# Altium schematic sheet Host.SchDoc: TITLE GOES HERE
size C; Author: EBK; CompanyName: Vaddio; Organization: Vaddio; Address1: 131 Cheshire Lane; Address2: Minnetonka, MN  55305; Address3: www.vaddio.com; Address4: 800-572-2011; SheetNumber: 1; SheetTotal: 1
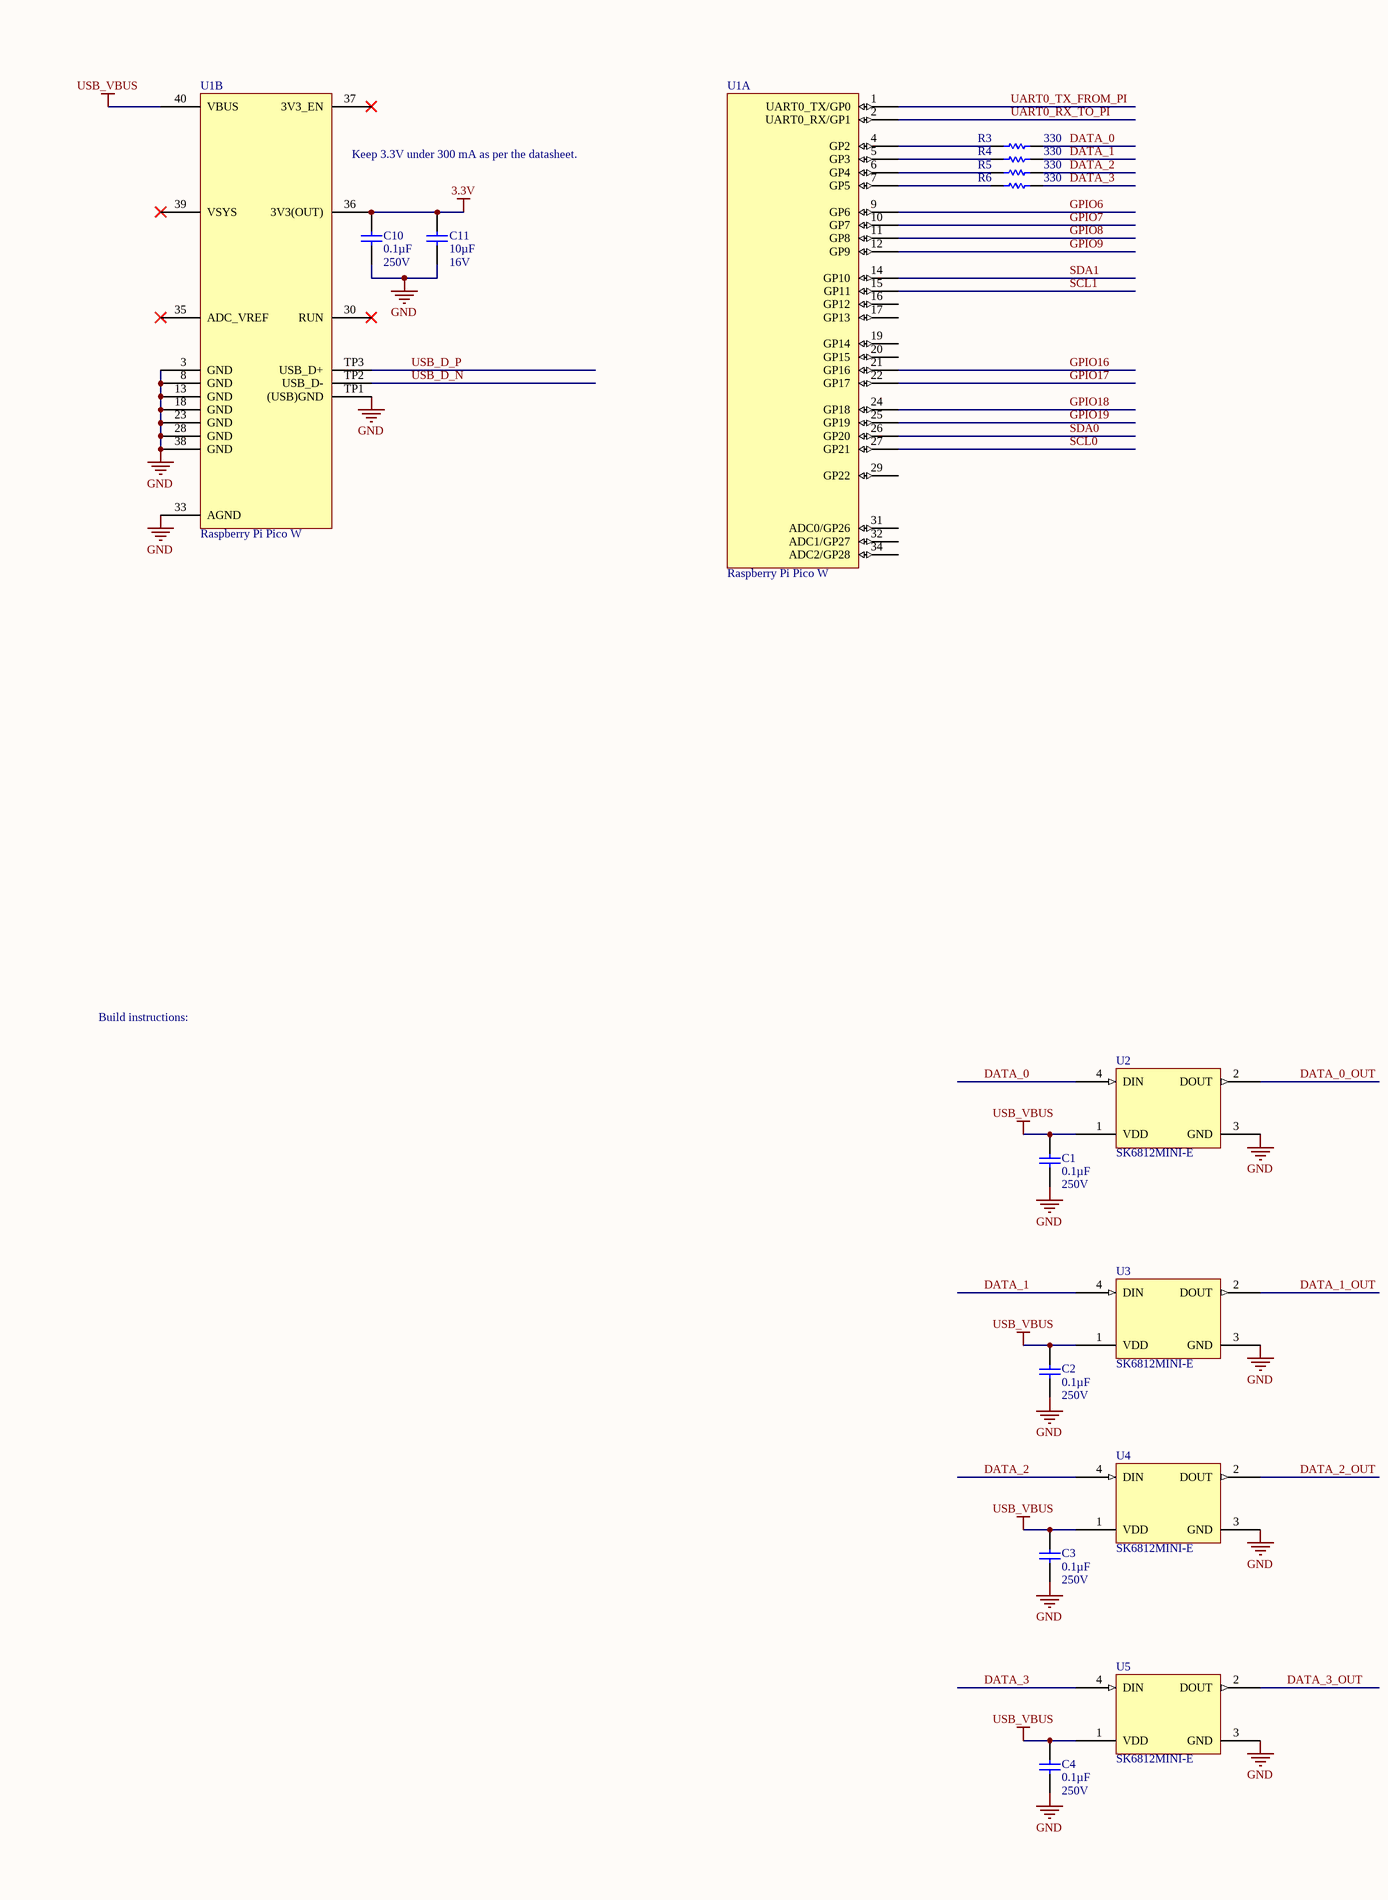
[diagram p0: Host.SchDoc, left]
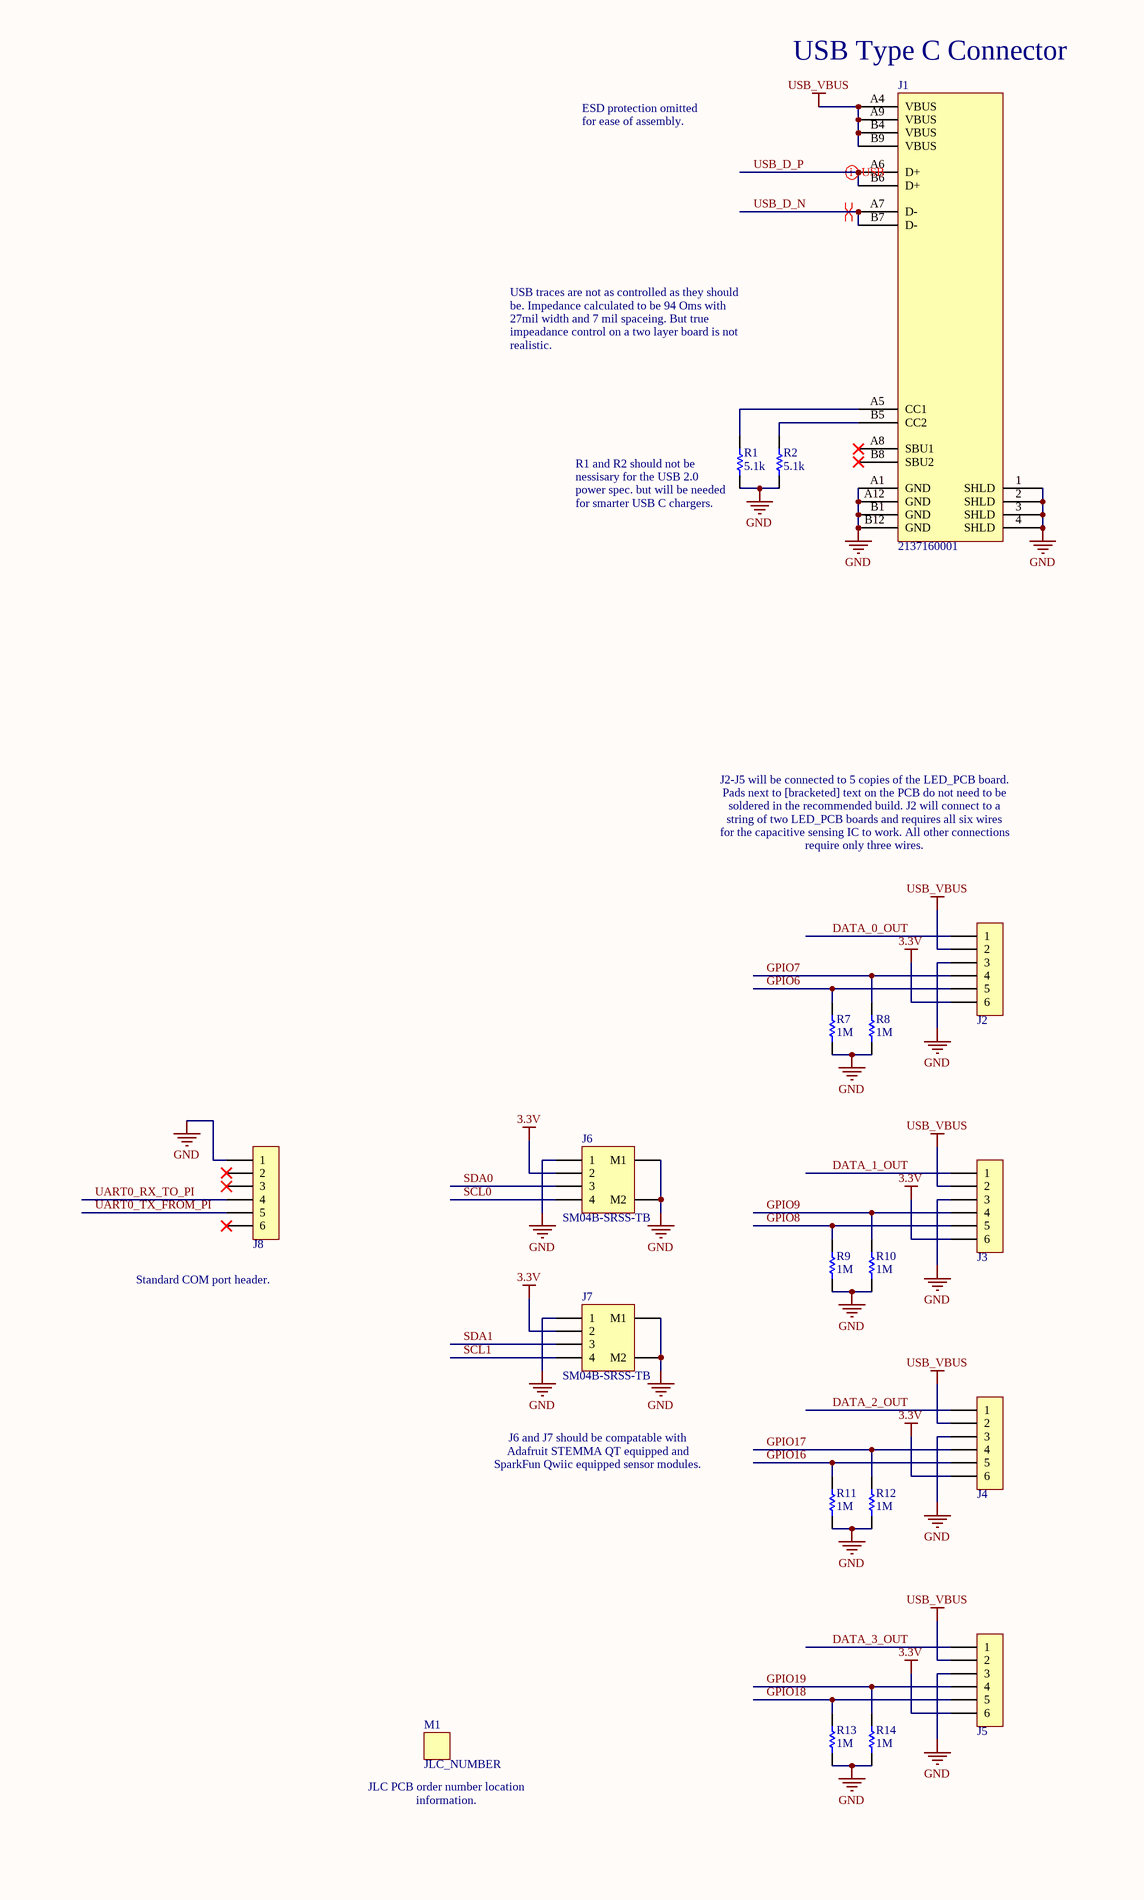
[diagram p1: Host.SchDoc, right]

## Parts
C1  0.1µF  Voltage: 250V  [Chip0805]
C2  0.1µF  Voltage: 250V  [Chip0805]
C3  0.1µF  Voltage: 250V  [Chip0805]
C4  0.1µF  Voltage: 250V  [Chip0805]
C10  0.1µF  Voltage: 250V  [Chip0805]
C11  10µF  Voltage: 16V  [Chip0805]
J1  2137160001  [MOLEX_2137160001]
J2  HEADER_1x6_NO_BOM  [HEADER_1x6_100mil_NP]  (value not drawn)  (no BOM)
J3  HEADER_1x6_NO_BOM  [HEADER_1x6_100mil_NP]  (value not drawn)  (no BOM)
J4  HEADER_1x6_NO_BOM  [HEADER_1x6_100mil_NP]  (value not drawn)  (no BOM)
J5  HEADER_1x6_NO_BOM  [HEADER_1x6_100mil_NP]  (value not drawn)  (no BOM)
J6  SM04B-SRSS-TB  [JST_SM04B-SRSS-TB]
J7  SM04B-SRSS-TB  [JST_SM04B-SRSS-TB]
J8  HEADER_1x6_NO_BOM  [HEADER_1x6_100mil_NP]  (value not drawn)  (no BOM)
M1  JLC_NUMBER  [JLC_NUMBER]  (no BOM)
R1  5.1k  [Chip0805]
R2  5.1k  [Chip0805]
R3  330  [Chip0805]
R4  330  [Chip0805]
R5  330  [Chip0805]
R6  330  [Chip0805]
R7  1M  [Chip0805]
R8  1M  [Chip0805]
R9  1M  [Chip0805]
R10  1M  [Chip0805]
R11  1M  [Chip0805]
R12  1M  [Chip0805]
R13  1M  [Chip0805]
R14  1M  [Chip0805]
U1  Raspberry Pi Pico W  [RASPBERRY_PI_PICO_W]  (parts A,B of 2)
U2  SK6812MINI-E  [SK6812MINI-E]
U3  SK6812MINI-E  [SK6812MINI-E]
U4  SK6812MINI-E  [SK6812MINI-E]
U5  SK6812MINI-E  [SK6812MINI-E]

## Nets
3.3V: C10.2 C11.2 J2.6 J3.6 J4.6 J5.6 J6.2 J7.2 U1.36(3V3(OUT))
GND: C1.1 C2.1 C3.1 C4.1 C10.1 C11.1 J1.1(SHLD) J1.2(SHLD) J1.3(SHLD) J1.4(SHLD) J1.A1(GND) J1.A12(GND) J1.B1(GND) J1.B12(GND) J2.3 J3.3 J4.3 J5.3 J6.1 J6.M1 J6.M2 J7.1 J7.M1 J7.M2 J8.1 R1.1 R2.1 R7.1 R8.1 R9.1 R10.1 R11.1 R12.1 R13.1 R14.1 U1.3(GND) U1.8(GND) U1.13(GND) U1.18(GND) U1.23(GND) U1.28(GND) U1.33(AGND) U1.38(GND) U1.TP1((USB)GND) U2.3(GND) U3.3(GND) U4.3(GND) U5.3(GND)
USB_VBUS: C1.2 C2.2 C3.2 C4.2 J1.A4(VBUS) J1.A9(VBUS) J1.B4(VBUS) J1.B9(VBUS) J2.2 J3.2 J4.2 J5.2 U1.40(VBUS) U2.1(VDD) U3.1(VDD) U4.1(VDD) U5.1(VDD)
DATA_0: R3.2 U2.4(DIN)
DATA_0_OUT: J2.1 U2.2(DOUT)
DATA_1: R4.2 U3.4(DIN)
DATA_1_OUT: J3.1 U3.2(DOUT)
DATA_2: R5.2 U4.4(DIN)
DATA_2_OUT: J4.1 U4.2(DOUT)
DATA_3: R6.2 U5.4(DIN)
DATA_3_OUT: J5.1 U5.2(DOUT)
GPIO6: J2.5 R7.2 U1.9(GP6)
GPIO7: J2.4 R8.2 U1.10(GP7)
GPIO8: J3.5 R9.2 U1.11(GP8)
GPIO9: J3.4 R10.2 U1.12(GP9)
GPIO16: J4.5 R11.2 U1.21(GP16)
GPIO17: J4.4 R12.2 U1.22(GP17)
GPIO18: J5.5 R13.2 U1.24(GP18)
GPIO19: J5.4 R14.2 U1.25(GP19)
SCL0: J6.4 U1.27(GP21)
SCL1: J7.4 U1.15(GP11)
SDA0: J6.3 U1.26(GP20)
SDA1: J7.3 U1.14(GP10)
UART0_RX_TO_PI: J8.4 U1.2(UART0_RX/GP1)
UART0_TX_FROM_PI: J8.5 U1.1(UART0_TX/GP0)
USB_D_N: J1.A7(D-) J1.B7(D-) U1.TP2(USB_D-)
USB_D_P: J1.A6(D+) J1.B6(D+) U1.TP3(USB_D+)
NetJ1_A5: J1.A5(CC1) R1.2
NetJ1_B5: J1.B5(CC2) R2.2
NetR3_1: R3.1 U1.4(GP2)
NetR4_1: R4.1 U1.5(GP3)
NetR5_1: R5.1 U1.6(GP4)
NetR6_1: R6.1 U1.7(GP5)

Not connected (* = marked no-connect by the designer): J1 A8(SBU1)* B8(SBU2)*; J8 2* 3* 6*; U1 16(GP12) 17(GP13) 19(GP14) 20(GP15) 29(GP22) 30(RUN)* 31(ADC0/GP26) 32(ADC1/GP27) 34(ADC2/GP28) 35(ADC_VREF)* 37(3V3_EN)* 39(VSYS)*

## Layout directives
differential pair; differential pair class DIFF90: USB_D_N, USB_D_P

## Notes on the sheet
- (near J1) USB Type C Connector
- (near U1) Keep 3.3V under 300 mA as per the datasheet.
- ESD protection omitted for ease of assembly.
- USB traces are not as controlled as they should be. Impedance calculated to be 94 Oms with 27mil width and 7 mil spaceing. But true impeadance control on a two layer board is not realistic.
- (near R1) R1 and R2 should not be nessisary for the USB 2.0 power spec. but will be needed for smarter USB C chargers.
- J2-J5 will be connected to 5 copies of the LED_PCB board. Pads next to [bracketed] text on the PCB do not need to be soldered in the recommended build. J2 will connect to a string of two LED_PCB boards and requires all six wires for the capacitive sensing IC to work. All other connections require only three wires.
- Build instructions:
- (near J8) Standard COM port header.
- J6 and J7 should be compatable with Adafruit STEMMA QT equipped and SparkFun Qwiic equipped sensor modules.
- (near M1) JLC PCB order number location information.
- Title:
- This work is licensed under a Creative Commons Attribution 4.0 International License. Derivative works should remove all Sophistry branding and ‘é’ watermark.
- Date:
- Engineer:
- Revision:
- Codename:
- Time:
- Variant:
- Sheet
- of

## Library data of the parts
C1-C4 C10 = C2012X7T2E104K125AA: CAP CER 0.1UF 250V 10% X7T 0805; Manufacturer: TDK Corporation; PartNumber: C2012X7T2E104K125AA; HelpURL: http://product.tdk.com/capacitor/mlcc/en/documents/mlcc_commercial_midvoltage_en.pdf; Supplier 1: Digi-Key; Supplier Part Number 1: 445-7749-1-ND; Supplier 2: Mouser; Manufacturer Part Number: C2012X7T2E104K125AA; Series: C; Capacitance: 0.1µF; Tolerance: ±10%; Temperature Coefficient: X7T; Mounting Type: Surface Mount, MLCC; Operating Temperature: -55°C ~ 125°C; Applications: General Purpose; Ratings: -; Package / Case: 0805 (2012 Metric); Size / Dimension: 0.079" L x 0.049" W (2.00mm x 1.25mm); Height - Seated (Max): -; Thickness (Max): 0.057" (1.45mm); Lead Spacing: -; Features: -; Lead Style: -
C11 = C2012X5R1C106K125AC: CAP CER 10UF 16V 10% X5R 0805; Manufacturer: TDK Corporation; PartNumber: C2012X5R1C106K125AC; HelpURL: http://product.tdk.com/capacitor/mlcc/en/documents/mlcc_commercial_general_en.pdf; Supplier 1: Digi-Key; Supplier Part Number 1: 445-7646-1-ND; Supplier 2: Mouser; Manufacturer Part Number: C2012X5R1C106K125AC; Series: C; Capacitance: 10µF; Tolerance: ±10%; Temperature Coefficient: X5R; Mounting Type: Surface Mount, MLCC; Operating Temperature: -55°C ~ 85°C; Applications: General Purpose; Ratings: -; Package / Case: 0805 (2012 Metric); Size / Dimension: 0.079" L x 0.049" W (2.00mm x 1.25mm); Height - Seated (Max): -; Thickness (Max): 0.057" (1.45mm); Lead Spacing: -; Features: -; Lead Style: -
J1 = 2137160001: CONN RCPT USB2.0 TYPE C 24POS RA; Manufacturer: Molex, LLC; PartNumber: 2137160001; Supplier 1: Digi-Key; Supplier 2: Mouser; Supplier Part Number 2: 538-213716-0001; HelpURL: https://www.molex.com/pdm_docs/sd/2137160001_sd.pdf; Supplier Part Number 1: 900-2137160001CT-ND; Manufacturer Part Number: 2137160001
J6 J7 = SM04B-SRSS-TB: CONN HEADER SMD R/A 4POS 1MM; Manufacturer: JST Sales America Inc.; PartNumber: SM04B-SRSS-TB; Supplier 1: Digi-Key; Supplier 2: Mouser; HelpURL: https://www.jst-mfg.com/product/pdf/eng/eSH.pdf; Supplier Part Number 1: 455-SM04B-SRSS-TBCT-ND; Manufacturer Part Number: SM04B-SRSS-TB
M1 = JLC_NUMBER: JLC Order Number Location; PartNumber: JLC_NUMBER; Manufacturer Part Number: JLC_NUMBER
R1 R2 = CRCW08055K10FKEA: RES 5.10K OHM 1/8W 1% 0805 SMD; Manufacturer: Vishay Dale; Power (Watts): 0.125W, 1/8W; Temperature Coefficient: ±100ppm/°C; PartNumber: CRCW08055K10FKEA; HelpURL: http://www.vishay.com/doc?20035; Supplier 1: Digi-Key; Supplier Part Number 1: 541-5.10KCCT-ND; Supplier 2: Mouser; Manufacturer Part Number: CRCW08055K10FKEA; Series: CRCW; Resistance: 5.1k; Tolerance: ±1%; Composition: Thick Film; Features: Automotive AEC-Q200 Qualified; Package / Case: 0805 (2012 Metric); Supplier Device Package: 0805 (2012 Metric); Size / Dimension: 0.079" L x 0.049" W (2.00mm x 1.25mm); Height: 0.020" (0.50mm); Number of Terminations: 2
R3-R6 = CRCW0805330RFKEA: RES 330 OHM 1/8W 1% 0805 SMD; Manufacturer: Vishay Dale; Power (Watts): 0.125W, 1/8W; Temperature Coefficient: ±100ppm/°C; PartNumber: CRCW0805330RFKEA; HelpURL: http://www.vishay.com/doc?20035; Supplier 1: Digi-Key; Supplier Part Number 1: 541-330CCT-ND; Supplier 2: Mouser; Manufacturer Part Number: CRCW0805330RFKEA; Series: CRCW; Resistance: 330; Tolerance: ±1%; Composition: Thick Film; Features: Automotive AEC-Q200 Qualified; Package / Case: 0805 (2012 Metric); Supplier Device Package: 0805 (2012 Metric); Size / Dimension: 0.079" L x 0.049" W (2.00mm x 1.25mm); Height: 0.020" (0.50mm); Number of Terminations: 2
R7-R14 = CRCW08051M00FKEA: RES 1.00M OHM 1/8W 1% 0805 SMD; Manufacturer: Vishay Dale; Power (Watts): 0.125W, 1/8W; Temperature Coefficient: ±100ppm/°C; PartNumber: CRCW08051M00FKEA; HelpURL: http://www.vishay.com/doc?20035; Supplier 1: Digi-Key; Supplier Part Number 1: 541-1.00MCCT-ND; Supplier 2: Mouser; Manufacturer Part Number: CRCW08051M00FKEA; Series: CRCW; Resistance: 1M; Tolerance: ±1%; Composition: Thick Film; Features: Automotive AEC-Q200 Qualified; Package / Case: 0805 (2012 Metric); Supplier Device Package: 0805 (2012 Metric); Size / Dimension: 0.079" L x 0.049" W (2.00mm x 1.25mm); Height: 0.020" (0.50mm); Number of Terminations: 2
U1 = Raspberry Pi Pico W: Manufacturer Part Number: SC0918; PartNumber: Raspberry Pi Pico W; Supplier 1: Digi-Key; Supplier Part Number 1: 2648-SC0918CT-ND; Manufacturer: Raspberry Pi
U2-U5 = SK6812MINI-E: Addressable RGB LED; Manufacturer: Adafruit Industries LLC; PartNumber: SK6812MINI-E; Datasheets: https://cdn-shop.adafruit.com/product-files/4960/4960_SK6812MINI-E_REV02_EN.pdf; Supplier 1: Digi-Key; Supplier Part Number 1: 1528-4960-ND; Manufacturer Part Number: SK6812MINI-E
J2-J5 J8 = HEADER_1x6_NO_BOM: PartNumber: HEADER_1x6_NO_BOM; Manufacturer Part Number: HEADER_1x6_NO_BOM